# EAGLE design led (EAGLE 7.6.0)
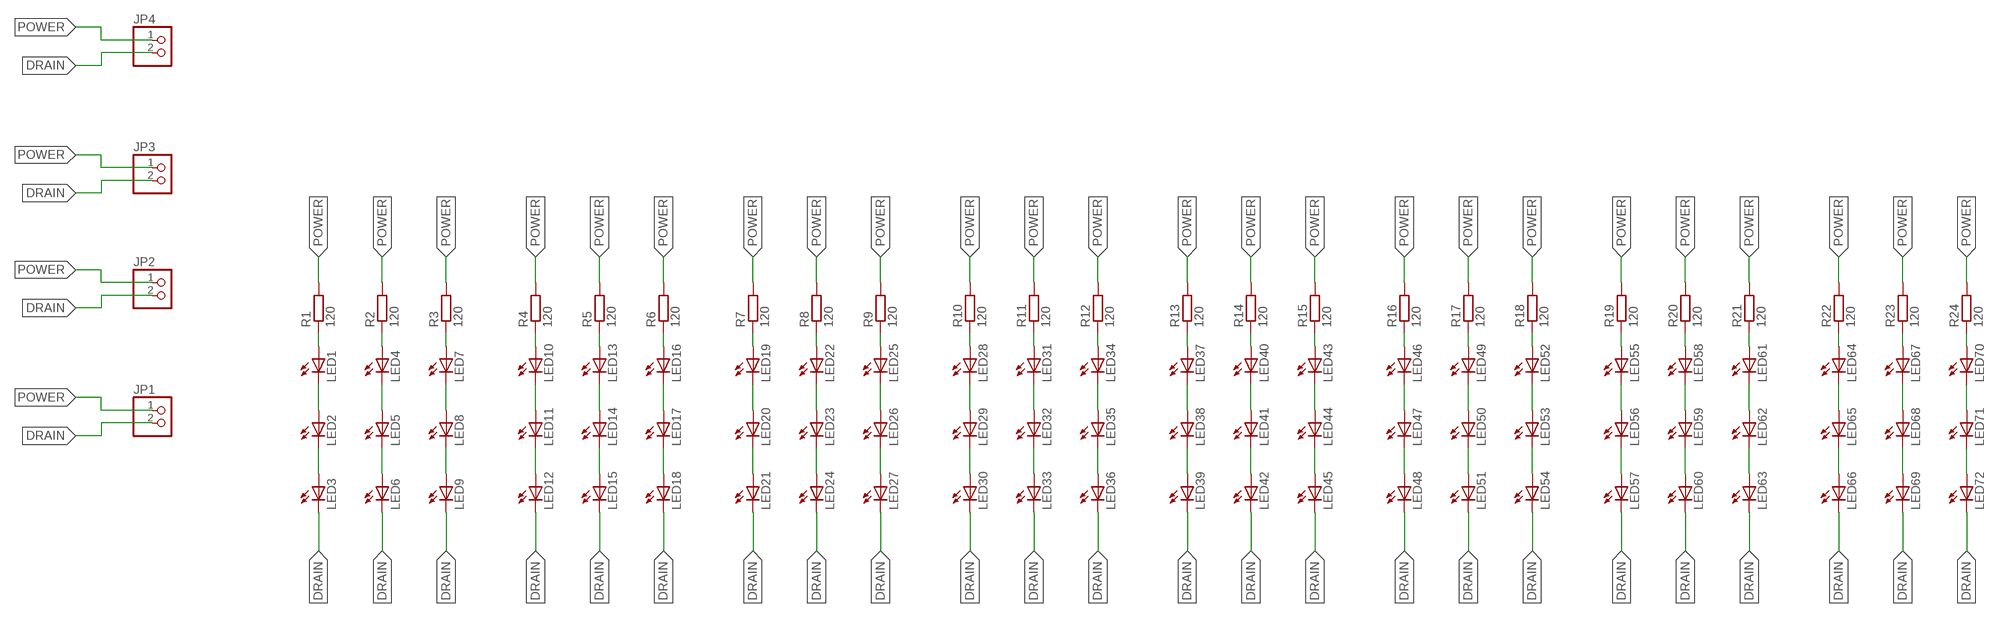
[diagram p0: schematic, sheet 1]

## Parts
JP1  PINHD-1X2  [1X02]
JP2  PINHD-1X2  [1X02]
JP3  PINHD-1X2  [1X02]
JP4  PINHD-1X2  [1X02]
LED1  LED5MM  [LED5MM]
LED2  LED5MM  [LED5MM]
LED3  LED5MM  [LED5MM]
LED4  LED5MM  [LED5MM]
LED5  LED5MM  [LED5MM]
LED6  LED5MM  [LED5MM]
LED7  LED5MM  [LED5MM]
LED8  LED5MM  [LED5MM]
LED9  LED5MM  [LED5MM]
LED10  LED5MM  [LED5MM]
LED11  LED5MM  [LED5MM]
LED12  LED5MM  [LED5MM]
LED13  LED5MM  [LED5MM]
LED14  LED5MM  [LED5MM]
LED15  LED5MM  [LED5MM]
LED16  LED5MM  [LED5MM]
LED17  LED5MM  [LED5MM]
LED18  LED5MM  [LED5MM]
LED19  LED5MM  [LED5MM]
LED20  LED5MM  [LED5MM]
LED21  LED5MM  [LED5MM]
LED22  LED5MM  [LED5MM]
LED23  LED5MM  [LED5MM]
LED24  LED5MM  [LED5MM]
LED25  LED5MM  [LED5MM]
LED26  LED5MM  [LED5MM]
LED27  LED5MM  [LED5MM]
LED28  LED5MM  [LED5MM]
LED29  LED5MM  [LED5MM]
LED30  LED5MM  [LED5MM]
LED31  LED5MM  [LED5MM]
LED32  LED5MM  [LED5MM]
LED33  LED5MM  [LED5MM]
LED34  LED5MM  [LED5MM]
LED35  LED5MM  [LED5MM]
LED36  LED5MM  [LED5MM]
LED37  LED5MM  [LED5MM]
LED38  LED5MM  [LED5MM]
LED39  LED5MM  [LED5MM]
LED40  LED5MM  [LED5MM]
LED41  LED5MM  [LED5MM]
LED42  LED5MM  [LED5MM]
LED43  LED5MM  [LED5MM]
LED44  LED5MM  [LED5MM]
LED45  LED5MM  [LED5MM]
LED46  LED5MM  [LED5MM]
LED47  LED5MM  [LED5MM]
LED48  LED5MM  [LED5MM]
LED49  LED5MM  [LED5MM]
LED50  LED5MM  [LED5MM]
LED51  LED5MM  [LED5MM]
LED52  LED5MM  [LED5MM]
LED53  LED5MM  [LED5MM]
LED54  LED5MM  [LED5MM]
LED55  LED5MM  [LED5MM]
LED56  LED5MM  [LED5MM]
LED57  LED5MM  [LED5MM]
LED58  LED5MM  [LED5MM]
LED59  LED5MM  [LED5MM]
LED60  LED5MM  [LED5MM]
LED61  LED5MM  [LED5MM]
LED62  LED5MM  [LED5MM]
LED63  LED5MM  [LED5MM]
LED64  LED5MM  [LED5MM]
LED65  LED5MM  [LED5MM]
LED66  LED5MM  [LED5MM]
LED67  LED5MM  [LED5MM]
LED68  LED5MM  [LED5MM]
LED69  LED5MM  [LED5MM]
LED70  LED5MM  [LED5MM]
LED71  LED5MM  [LED5MM]
LED72  LED5MM  [LED5MM]
R1  120  R-EU_R0805  [R0805]
R2  120  R-EU_R0805  [R0805]
R3  120  R-EU_R0805  [R0805]
R4  120  R-EU_R0805  [R0805]
R5  120  R-EU_R0805  [R0805]
R6  120  R-EU_R0805  [R0805]
R7  120  R-EU_R0805  [R0805]
R8  120  R-EU_R0805  [R0805]
R9  120  R-EU_R0805  [R0805]
R10  120  R-EU_R0805  [R0805]
R11  120  R-EU_R0805  [R0805]
R12  120  R-EU_R0805  [R0805]
R13  120  R-EU_R0805  [R0805]
R14  120  R-EU_R0805  [R0805]
R15  120  R-EU_R0805  [R0805]
R16  120  R-EU_R0805  [R0805]
R17  120  R-EU_R0805  [R0805]
R18  120  R-EU_R0805  [R0805]
R19  120  R-EU_R0805  [R0805]
R20  120  R-EU_R0805  [R0805]
R21  120  R-EU_R0805  [R0805]
R22  120  R-EU_R0805  [R0805]
R23  120  R-EU_R0805  [R0805]
R24  120  R-EU_R0805  [R0805]

## Nets
DRAIN: JP1.2 JP2.2 JP3.2 JP4.2 LED3.K(C) LED6.K(C) LED9.K(C) LED12.K(C) LED15.K(C) LED18.K(C) LED21.K(C) LED24.K(C) LED27.K(C) LED30.K(C) LED33.K(C) LED36.K(C) LED39.K(C) LED42.K(C) LED45.K(C) LED48.K(C) LED51.K(C) LED54.K(C) LED57.K(C) LED60.K(C) LED63.K(C) LED66.K(C) LED69.K(C) LED72.K(C)
N$1: LED2.K(C) LED3.A
N$2: LED1.K(C) LED2.A
N$3: LED1.A R1.1
N$5: LED5.K(C) LED6.A
N$7: LED4.K(C) LED5.A
N$8: LED4.A R2.1
N$9: LED8.K(C) LED9.A
N$10: LED7.K(C) LED8.A
N$11: LED7.A R3.1
N$12: LED11.K(C) LED12.A
N$13: LED10.K(C) LED11.A
N$14: LED10.A R4.1
N$15: LED14.K(C) LED15.A
N$16: LED13.K(C) LED14.A
N$17: LED13.A R5.1
N$18: LED17.K(C) LED18.A
N$19: LED16.K(C) LED17.A
N$20: LED16.A R6.1
N$21: LED20.K(C) LED21.A
N$22: LED19.K(C) LED20.A
N$23: LED19.A R7.1
N$24: LED23.K(C) LED24.A
N$25: LED22.K(C) LED23.A
N$26: LED22.A R8.1
N$27: LED26.K(C) LED27.A
N$28: LED25.K(C) LED26.A
N$29: LED25.A R9.1
N$30: LED29.K(C) LED30.A
N$31: LED28.K(C) LED29.A
N$32: LED28.A R10.1
N$33: LED32.K(C) LED33.A
N$34: LED31.K(C) LED32.A
N$35: LED31.A R11.1
N$36: LED35.K(C) LED36.A
N$37: LED34.K(C) LED35.A
N$38: LED34.A R12.1
N$39: LED38.K(C) LED39.A
N$40: LED37.K(C) LED38.A
N$41: LED37.A R13.1
N$42: LED41.K(C) LED42.A
N$43: LED40.K(C) LED41.A
N$44: LED40.A R14.1
N$45: LED44.K(C) LED45.A
N$46: LED43.K(C) LED44.A
N$47: LED43.A R15.1
N$48: LED47.K(C) LED48.A
N$49: LED46.K(C) LED47.A
N$50: LED46.A R16.1
N$51: LED50.K(C) LED51.A
N$52: LED49.K(C) LED50.A
N$53: LED49.A R17.1
N$54: LED53.K(C) LED54.A
N$55: LED52.K(C) LED53.A
N$56: LED52.A R18.1
N$57: LED56.K(C) LED57.A
N$58: LED55.K(C) LED56.A
N$59: LED55.A R19.1
N$60: LED59.K(C) LED60.A
N$61: LED58.K(C) LED59.A
N$62: LED58.A R20.1
N$63: LED62.K(C) LED63.A
N$64: LED61.K(C) LED62.A
N$65: LED61.A R21.1
N$66: LED65.K(C) LED66.A
N$67: LED64.K(C) LED65.A
N$68: LED64.A R22.1
N$69: LED68.K(C) LED69.A
N$70: LED67.K(C) LED68.A
N$71: LED67.A R23.1
N$72: LED71.K(C) LED72.A
N$73: LED70.K(C) LED71.A
N$74: LED70.A R24.1
POWER: JP1.1 JP2.1 JP3.1 JP4.1 R1.2 R2.2 R3.2 R4.2 R5.2 R6.2 R7.2 R8.2 R9.2 R10.2 R11.2 R12.2 R13.2 R14.2 R15.2 R16.2 R17.2 R18.2 R19.2 R20.2 R21.2 R22.2 R23.2 R24.2

## Library data of the parts
JP1-JP4 = pinhead:PINHD-1X2: PIN HEADER
LED1-LED72 = led:LED: LED OSRAM: - CHIPLED LG R971, LG N971, LY N971, LG Q971, LY Q971, LO R971, LY R971 LH N974, LH R974 LS Q976, LO Q976, LY Q976 LO Q996 - Hyper CHIPLED LW Q18S LB Q993, LB Q99A, LB R99A - SideLED LS A670, LO A670, LY A670, LG A670, LP A670 LB A673, LV A673, LT A673, LW A673 LH A674 LY A675 LS A676, LA A676, LO A676, LY A676, LW A676 LS A679, LY A679, LG A679 - Hyper Micro SIDELED® LS Y876, LA Y876, LO Y876, LY Y876 LT Y87S - SmartLED LW L88C, LW L88S LB L89C, LB L89S, LG L890 LS L89K, LO L89K, LY L89K LS L896, LA L896, LO L896, LY L896 - TOPLED LS T670, LO T670, LY T670, LG T670, LP T670 LSG T670, LSP T670, LSY T670, LOP T670, LYG T670 LG T671, LOG T671, LSG T671 LB T673, LV T673, LT T673, LW T673 LH T674 LS T676, LA T676, LO T676, LY T676, LB T676, LH T676, LSB T676, LW T676 LB T67C, LV T67C, LT T67C, LS T67K, LO T67K, LY T67K, LW E67C LS E67B, LA E67B, LO E67B, LY E67B, LB E67C, LV E67C, LT E67C LW T67C LS T679, LY T679, LG T679 LS T770, LO T770, LY T770, LG T770, LP T770 LB T773, LV T773, LT T773, LW T773 LH T774 LS E675, LA E675, LY E675, LS T675 LS T776, LA T776, LO T776, LY T776, LB T776 LHGB T686 LT T68C, LB T68C - Hyper Mini TOPLED® LB M676 - Mini TOPLED Santana® LG M470 LS M47K, LO M47K, LY M47K Source: http://www.osram.convergy.de LUXEON: - LUMILED® LXK2-PW12-R00, LXK2-PW12-S00, LXK2-PW14-U00, LXK2-PW14-V00 LXK2-PM12-R00, LXK2-PM12-S00, LXK2-PM14-U00 LXK2-PE12-Q00, LXK2-PE12-R00, LXK2-PE12-S00, LXK2-PE14-T00, LXK2-PE14-U00 LXK2-PB12-K00, LXK2-PB12-L00, LXK2-PB12-M00, LXK2-PB14-N00, LXK2-PB14-P00, LXK2-PB14-Q00 LXK2-PR12-L00, LXK2-PR12-M00, LXK2-PR14-Q00, LXK2-PR14-R00 LXK2-PD12-Q00, LXK2-PD12-R00, LXK2-PD12-S00 LXK2-PH12-R00, LXK2-PH12-S00 LXK2-PL12-P00, LXK2-PL12-Q00, LXK2-PL12-R00 Source: www.luxeon.com KINGBRIGHT: KA-3528ASYC Source: www.kingbright.com
R1-R24 = rcl:R-EU_: RESISTOR, European symbol

## Board
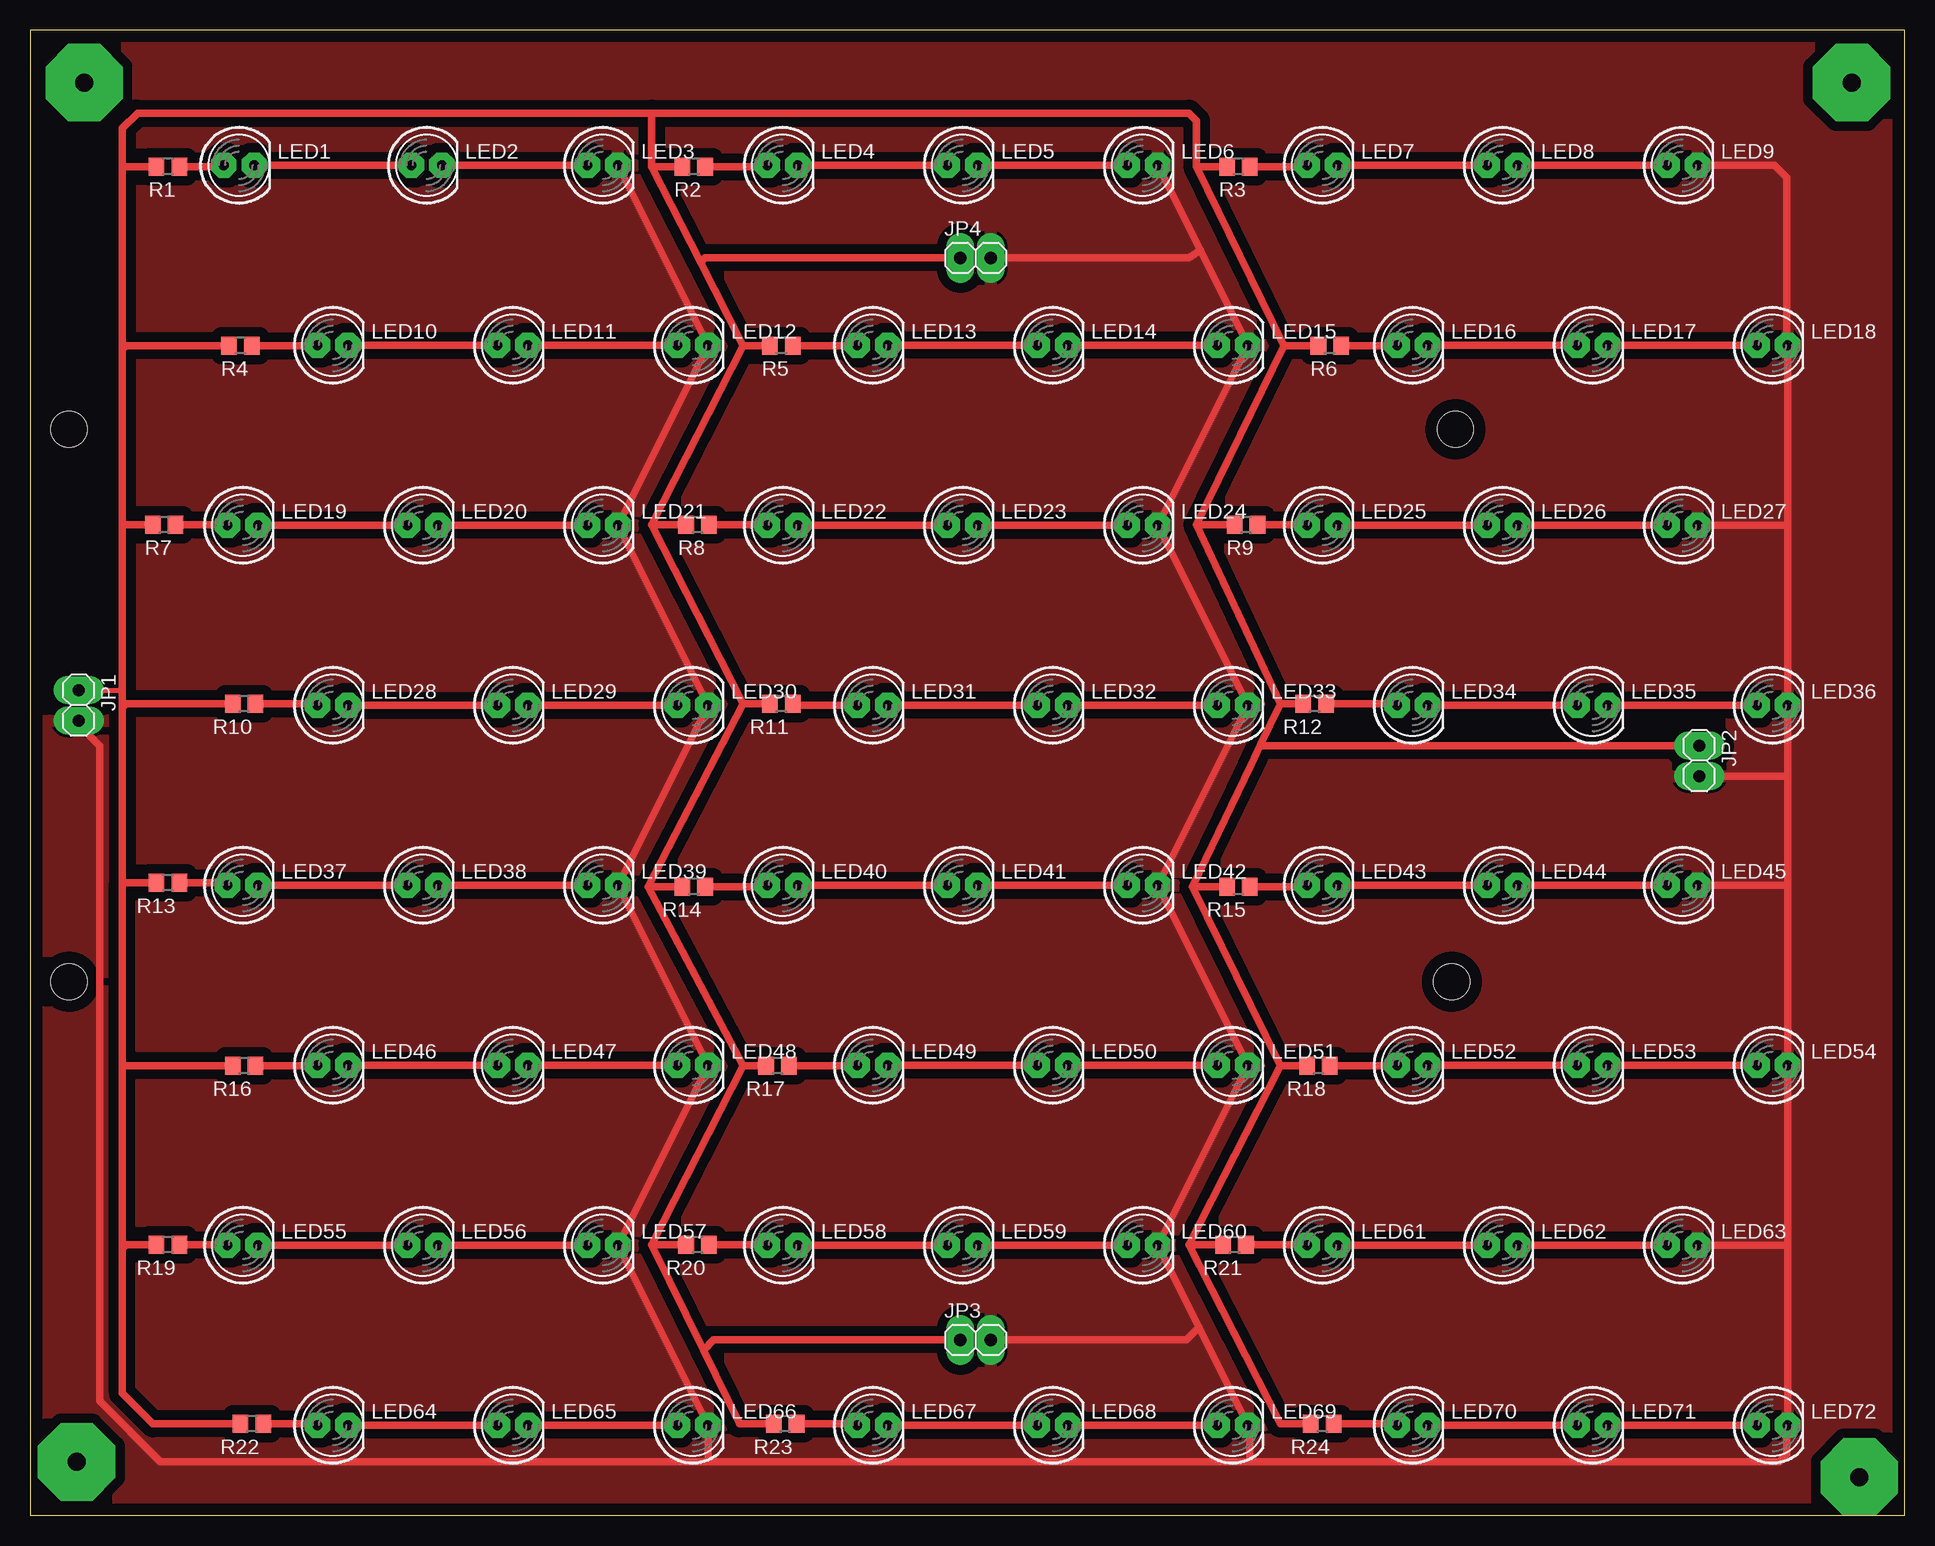
[diagram p1: board, top side]

Size 156.27 x 123.77 mm. Coordinates in mm from the lower left corner, seen from the top.
Outline: 0,0 156.27,0 156.27,123.77 0,123.77 0,0
Copper layers (1*16): Top 0.035mm / dielectric 1.5mm / Bottom 0.035mm
Design rules "default *": minimum track width 0.2mm, minimum drill 0.1mm, track to track 0.2mm, track to pad 0.2mm, pad to pad 0.2mm, via to via 1mm, smd to smd 0mil, copper to edge 1mm, drill to drill 1.5mm, minimum pad ring 0.65mm, minimum via ring 0.65mm, stop-mask expansion 4mil, vias tented up to drill 0mil, thermal gap 10mil
Holes 3 mm at 3.25,44.45 3.25,90.49 118.82,90.49 118.5,44.45

### Footprints (pad centres in the part's own frame; a part is rotated, then mirrored left to right if it is on the bottom)
1X02 = drill 1.016 long: 1 -1.27,0; 2 1.27,0
LED5MM = drill 0.813 pad 1 octagon: A -1.27,0; K 1.27,0
R0805 = smd 1.3 x 1.5: 1 -0.95,0; 2 0.95,0

### Placement (x,y rotation side)
JP1  4.06,67.48 270 top
JP2  139.14,62.87 270 top
JP3  78.82,14.61 0 top
JP4  78.82,104.78 0 top
LED1  17.42,112.5 0 top
LED2  33.05,112.5 0 top
LED3  47.74,112.5 0 top
LED4  62.74,112.5 0 top
LED5  77.74,112.5 0 top
LED6  92.74,112.5 0 top
LED7  107.74,112.5 0 top
LED8  122.74,112.5 0 top
LED9  137.74,112.5 0 top
LED10  25.24,97.5 0 top
LED11  40.24,97.5 0 top
LED12  55.24,97.5 0 top
LED13  70.24,97.5 0 top
LED14  85.24,97.5 0 top
LED15  100.24,97.5 0 top
LED16  115.24,97.5 0 top
LED17  130.24,97.5 0 top
LED18  145.24,97.5 0 top
LED19  17.74,82.5 0 top
LED20  32.74,82.5 0 top
LED21  47.74,82.5 0 top
LED22  62.74,82.5 0 top
LED23  77.74,82.5 0 top
LED24  92.74,82.5 0 top
LED25  107.74,82.5 0 top
LED26  122.74,82.5 0 top
LED27  137.74,82.5 0 top
LED28  25.24,67.5 0 top
LED29  40.24,67.5 0 top
LED30  55.24,67.5 0 top
LED31  70.24,67.5 0 top
LED32  85.24,67.5 0 top
LED33  100.24,67.5 0 top
LED34  115.24,67.5 0 top
LED35  130.24,67.5 0 top
LED36  145.24,67.5 0 top
LED37  17.74,52.5 0 top
LED38  32.74,52.5 0 top
LED39  47.74,52.5 0 top
LED40  62.74,52.5 0 top
LED41  77.74,52.5 0 top
LED42  92.74,52.5 0 top
LED43  107.74,52.5 0 top
LED44  122.74,52.5 0 top
LED45  137.74,52.5 0 top
LED46  25.24,37.5 0 top
LED47  40.24,37.5 0 top
LED48  55.24,37.5 0 top
LED49  70.24,37.5 0 top
LED50  85.24,37.5 0 top
LED51  100.24,37.5 0 top
LED52  115.24,37.5 0 top
LED53  130.24,37.5 0 top
LED54  145.24,37.5 0 top
LED55  17.74,22.5 0 top
LED56  32.74,22.5 0 top
LED57  47.74,22.5 0 top
LED58  62.74,22.5 0 top
LED59  77.74,22.5 0 top
LED60  92.74,22.5 0 top
LED61  107.74,22.5 0 top
LED62  122.74,22.5 0 top
LED63  137.74,22.5 0 top
LED64  25.24,7.5 0 top
LED65  40.24,7.5 0 top
LED66  55.24,7.5 0 top
LED67  70.24,7.5 0 top
LED68  85.24,7.5 0 top
LED69  100.24,7.5 0 top
LED70  115.24,7.5 0 top
LED71  130.24,7.5 0 top
LED72  145.24,7.5 0 top
R1  11.51,112.39 180 top
R2  55.32,112.39 180 top
R3  100.72,112.39 180 top
R4  17.54,97.47 180 top
R5  62.62,97.47 180 top
R6  108.34,97.47 180 top
R7  11.19,82.55 180 top
R8  55.64,82.55 180 top
R9  101.36,82.55 180 top
R10  17.86,67.63 180 top
R11  62.62,67.63 180 top
R12  107.08,67.63 180 top
R13  11.51,52.7 180 top
R14  55.32,52.39 180 top
R15  100.72,52.39 180 top
R16  17.86,37.47 180 top
R17  62.31,37.47 180 top
R18  107.39,37.47 180 top
R19  11.51,22.54 180 top
R20  55.64,22.54 180 top
R21  100.41,22.54 180 top
R22  18.49,7.62 180 top
R23  62.94,7.62 180 top
R24  107.71,7.62 180 top

### Tracks (layer width: path | path; a pad name or v marks a point on that pad's centre or on a via)
DRAIN
  Top 0.61: 97.43,15.66 LED60.K LED51.K LED42.K LED33.K LED24.K LED15.K 97.55,105.41 | 97.43,15.66 LED69.K | 48.97,112.53 LED3.K LED12.K LED21.K LED30.K LED39.K LED48.K LED57.K LED66.K 56.51,4.53 56.59,4.45 | 139.14,112.64 LED9.K 145.39,112.5 146.45,111.44 146.45,97.56 LED18.K 146.51,82.55 | 146.51,22.54 LED72.K 146.45,7.44 146.45,5.08 145.81,4.45 101.68,4.45 | 146.51,22.54 LED54.K 146.51,52.7 | 146.51,52.7 146.51,61.59 | 146.51,61.59 LED36.K 146.51,82.55 | LED27.K 146.46,82.5 146.51,82.55 | LED45.K 146.3,52.5 146.51,52.7 | LED63.K 146.46,22.5 146.51,22.54 | 97.43,15.66 96.38,14.61 JP3.2 | JP4.2 96.6,104.78 97.55,105.41 | LED6.K 97.55,105.41 | JP1.2 3.72,66.21 5.79,64.14 5.79,9.53 10.87,4.45 56.59,4.45 | 56.59,4.45 101.68,4.45 | 101.68,4.45 101.68,7.3 101.36,7.62 | JP2.2 146.51,61.59
  pour Top (isolate 0.813): 0.08,123.83 156.29,123.83 156.29,0 0.08,0
N$1
  Top 0.61: LED2.K LED3.A
N$2
  Top 0.61: LED1.K LED2.A
N$3
  Top 0.61: R1.1 15.94,112.39 LED1.A
N$4  (via drill 1.5 pad 6.45)
  other vias: 3.89,4.45
N$5
  Top 0.61: LED5.K LED6.A
N$6  (via drill 1.5 pad 6.45)
  other vias: 152.48,3.17
N$7
  Top 0.61: LED4.K LED5.A
N$8
  Top 0.61: R2.1 61.36,112.39 LED4.A
N$9
  Top 0.61: LED8.K LED9.A
N$10
  Top 0.61: LED7.K LED8.A
N$11
  Top 0.61: R3.1 106.36,112.39 LED7.A
N$12
  Top 0.61: LED11.K LED12.A
N$13
  Top 0.61: LED10.K LED11.A
N$14
  Top 0.61: R4.1 23.94,97.47 LED10.A
N$15
  Top 0.61: LED15.A LED14.K
N$16
  Top 0.61: LED14.A LED13.K
N$17
  Top 0.61: R5.1 68.94,97.47 LED13.A
N$18
  Top 0.61: LED17.K LED18.A
N$19
  Top 0.61: LED16.K LED17.A
N$20
  Top 0.61: R6.1 113.94,97.47 LED16.A
N$21
  Top 0.61: LED21.A LED20.K
N$22
  Top 0.61: LED20.A LED19.K
N$23
  Top 0.61: R7.1 16.42,82.55 LED19.A
N$24
  Top 0.61: LED23.K LED24.A
N$25
  Top 0.61: LED22.K LED23.A
N$26
  Top 0.61: R8.1 61.42,82.55 LED22.A
N$27
  Top 0.61: LED27.A LED26.K
N$28
  Top 0.61: LED26.A LED25.K
N$29
  Top 0.61: R9.1 106.42,82.55 LED25.A
N$30
  Top 0.61: LED29.K LED30.A
N$31
  Top 0.61: LED28.K LED29.A
N$32
  Top 0.61: R10.1 23.84,67.63 LED28.A
N$33
  Top 0.61: LED33.A LED32.K
N$34
  Top 0.61: LED32.A LED31.K
N$35
  Top 0.61: LED31.A 64.17,67.5 R11.1
N$36
  Top 0.61: LED36.A LED35.K
N$37
  Top 0.61: LED35.A LED34.K
N$38
  Top 0.61: R12.1 113.84,67.63 LED34.A
N$39
  Top 0.61: LED38.K LED39.A
N$40
  Top 0.61: LED37.K LED38.A
N$41
  Top 0.61: R13.1 16.26,52.7 LED37.A
N$42
  Top 0.61: LED41.K LED42.A
N$43
  Top 0.61: LED40.K LED41.A
N$44
  Top 0.61: R14.1 61.36,52.39 LED40.A
N$45
  Top 0.61: LED44.K LED45.A
N$46
  Top 0.61: LED43.K LED44.A
N$47
  Top 0.61: R15.1 106.36,52.39 LED43.A
N$48
  Top 0.61: LED48.A LED47.K
N$49
  Top 0.61: LED46.K LED47.A
N$50
  Top 0.61: R16.1 23.93,37.47 LED46.A
N$51
  Top 0.61: LED51.A LED50.K
N$52
  Top 0.61: LED50.A LED49.K
N$53
  Top 0.61: R17.1 68.93,37.47 LED49.A
N$54
  Top 0.61: LED53.K LED54.A
N$55
  Top 0.61: LED52.K LED53.A
N$56
  Top 0.61: R18.1 113.93,37.47 LED52.A
N$57
  Top 0.61: LED56.K LED57.A
N$58
  Top 0.61: LED55.K LED56.A
N$59
  Top 0.61: R19.1 16.43,22.54 LED55.A
N$60
  Top 0.61: LED59.K LED60.A
N$61
  Top 0.61: LED58.K LED59.A
N$62
  Top 0.61: R20.1 61.42,22.54 LED58.A
N$63
  Top 0.61: LED63.A LED62.K
N$64
  Top 0.61: LED62.A LED61.K
N$65
  Top 0.61: R21.1 106.42,22.54 LED61.A
N$66
  Top 0.61: LED66.A LED65.K
N$67
  Top 0.61: LED65.A LED64.K
N$68
  Top 0.61: R22.1 23.85,7.62 LED64.A
N$69
  Top 0.61: LED68.K LED69.A
N$70
  Top 0.61: LED67.K LED68.A
N$71
  Top 0.61: R23.1 68.85,7.62 LED67.A
N$72
  Top 0.61: LED72.A LED71.K
N$73
  Top 0.61: LED71.A LED70.K
N$74
  Top 0.61: R24.1 113.85,7.62 LED70.A
N$75  (via drill 1.5 pad 6.45)
  other vias: 151.84,119.38
N$76  (via drill 1.5 pad 6.45)
  other vias: 4.52,119.38
POWER
  Top 0.406: JP1.1 7.53,68.75 7.7,68.58
  Top 0.61: 7.7,52.7 R13.2 | R1.2 7.7,112.39 | 7.7,112.39 7.7,115.57 8.97,116.84 51.83,116.84 | 7.7,112.39 7.7,97.16 | 7.7,97.16 7.7,82.55 | 7.7,82.55 7.7,68.58 7.7,67.31 | 7.7,67.31 7.7,52.7 | R4.2 8.02,97.47 7.7,97.16 | R7.2 7.7,82.55 | R10.2 8.02,67.63 7.7,67.31 | 7.7,22.23 7.7,37.47 | 7.7,37.47 7.7,52.7 | R16.2 7.7,37.47 | R19.2 8.02,22.54 7.7,22.23 | R24.2 104.22,7.62 100.34,15.21 96.6,22.54 | R23.2 59.13,7.62 56.13,13.75 | R5.2 59.45,97.47 | 51.83,112.39 R2.2 | R11.2 59.45,67.63 | R14.2 51.51,52.39 | R17.2 59.45,37.47 | R20.2 51.83,22.54 | R8.2 51.83,82.55 | 56.13,13.75 51.83,22.54 | 59.45,37.47 51.83,22.54 | 59.45,37.47 51.51,52.39 | 59.45,67.63 51.51,52.39 | 59.45,67.63 51.83,82.55 | 59.45,97.47 51.83,82.55 | R21.2 96.6,22.54 | R18.2 104.22,37.47 | R15.2 96.92,52.39 | R12.2 104.22,67.63 | R9.2 97.23,82.55 | R6.2 104.53,97.47 | R3.2 97.23,112.39 | 104.22,37.47 96.6,22.54 | 104.22,37.47 96.92,52.39 | 104.22,67.63 102.62,64.29 | 102.62,64.29 101.76,62.49 96.92,52.39 | 104.22,67.63 97.23,82.55 | 104.53,97.47 97.23,82.55 | 104.53,97.47 97.23,112.39 | 59.45,97.47 55.9,104.42 | 55.9,104.42 51.83,112.39 | JP3.1 56.99,14.61 56.13,13.75 | JP4.1 56.25,104.78 55.9,104.42 | 97.23,112.39 97.23,116.2 96.6,116.84 51.83,116.84 | 51.83,116.84 51.83,112.39 | R22.2 10.24,7.62 7.7,10.16 7.7,22.23 | JP2.1 102.78,64.14 102.62,64.29